# Altium schematic sheet Sheet2.SchDoc
size A3
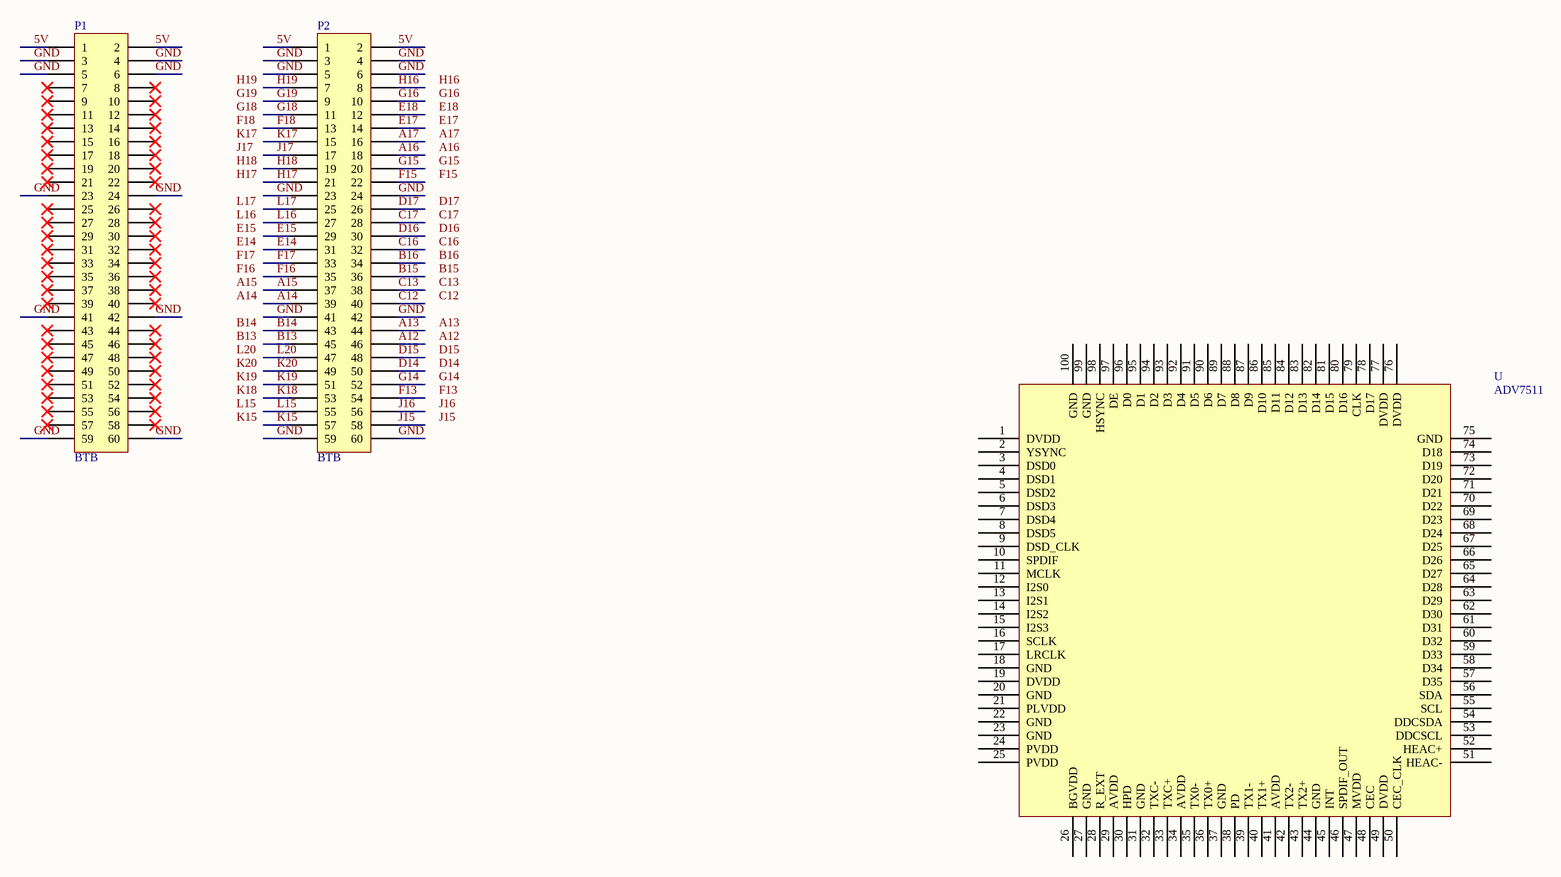
[diagram p0: Sheet2.SchDoc]

## Parts
P1  BTB  [BTBCON_0.8mm_60P]
P2  BTB  [BTBCON_0.8mm_60P]
U  ADV7511

## Nets
5V: P1.1 P1.2 P2.1 P2.2
A12: P2.46
A13: P2.44
A14: P2.39
A15: P2.37
A16: P2.18
A17: P2.16
B13: P2.45
B14: P2.43
B15: P2.36
B16: P2.34
C12: P2.40
C13: P2.38
C16: P2.32
C17: P2.28
D14: P2.50
D15: P2.48
D16: P2.30
D17: P2.26
E14: P2.31
E15: P2.29
E17: P2.14
E18: P2.12
F13: P2.54
F15: P2.22
F16: P2.35
F17: P2.33
F18: P2.13
G14: P2.52
G15: P2.20
G16: P2.10
G18: P2.11
G19: P2.9
GND: P1.3 P1.4 P1.5 P1.6 P1.23 P1.24 P1.41 P1.42 P1.59 P1.60 P2.3 P2.4 P2.5 P2.6 P2.23 P2.24 P2.41 P2.42 P2.59 P2.60
H16: P2.8
H17: P2.21
H18: P2.19
H19: P2.7
J15: P2.58
J16: P2.56
J17: P2.17
K15: P2.57
K17: P2.15
K18: P2.53
K19: P2.51
K20: P2.49
L15: P2.55
L16: P2.27
L17: P2.25
L20: P2.47

Not connected (* = marked no-connect by the designer): P1 7* 8* 9* 10* 11* 12* 13* 14* 15* 16* 17* 18* 19* 20* 21* 22* 25* 26* 27* 28* 29* 30* 31* 32* 33* 34* 35* 36* 37* 38* 39* 40* 43* 44* 45* 46* 47* 48* 49* 50* 51* 52* 53* 54* 55* 56* 57* 58*; U 1(DVDD) 2(YSYNC) 3(DSD0) 4(DSD1) 5(DSD2) 6(DSD3) 7(DSD4) 8(DSD5) 9(DSD_CLK) 10(SPDIF) 11(MCLK) 12(I2S0) 13(I2S1) 14(I2S2) 15(I2S3) 16(SCLK) 17(LRCLK) 18(GND) 19(DVDD) 20(GND) 21(PLVDD) 22(GND) 23(GND) 24(PVDD) 25(PVDD) 26(BGVDD) 27(GND) 28(R_EXT) 29(AVDD) 30(HPD) 31(GND) 32(TXC-) 33(TXC+) 34(AVDD) 35(TX0-) 36(TX0+) 37(GND) 38(PD) 39(TX1-) 40(TX1+) 41(AVDD) 42(TX2-) 43(TX2+) 44(GND) 45(INT) 46(SPDIF_OUT) 47(MVDD) 48(CEC) 49(DVDD) 50(CEC_CLK) 51(HEAC-) 52(HEAC+) 53(DDCSCL) 54(DDCSDA) 55(SCL) 56(SDA) 57(D35) 58(D34) 59(D33) 60(D32) 61(D31) 62(D30) 63(D29) 64(D28) 65(D27) 66(D26) 67(D25) 68(D24) 69(D23) 70(D22) 71(D21) 72(D20) 73(D19) 74(D18) 75(GND) 76(DVDD) 77(DVDD) 78(D17) 79(CLK) 80(D16) 81(D15) 82(D14) 83(D13) 84(D12) 85(D11) 86(D10) 87(D9) 88(D8) 89(D7) 90(D6) 91(D5) 92(D4) 93(D3) 94(D2) 95(D1) 96(D0) 97(DE) 98(HSYNC) 99(GND) 100(GND)

## Notes on the sheet
- Labels drawn without touching a wire or pin: A12, A13, A14, A15, A16, A17, B13, B14, B15, B16, C12, C13, C16, C17, D14, D15, D16, D17, E14, E15, E17, E18, F13, F15, F16, F17, F18, G14, G15, G16, G18, G19, H16, H17, H18, H19, J15, J16, J17, K15, K17, K18, K19, K20, L15, L16, L17, L20

## Library data of the parts
P1 P2 = Header 30X2: Header, 30-Pin, Dual row; LatestRevisionDate: 17-Jul-2002; LatestRevisionNote: Re-released for DXP Platform.; Publisher: Altium Limited